# Altium schematic sheet Main.SchDoc
size A4; DocumentNumber: 1; SheetNumber: 1; SheetTotal: 8
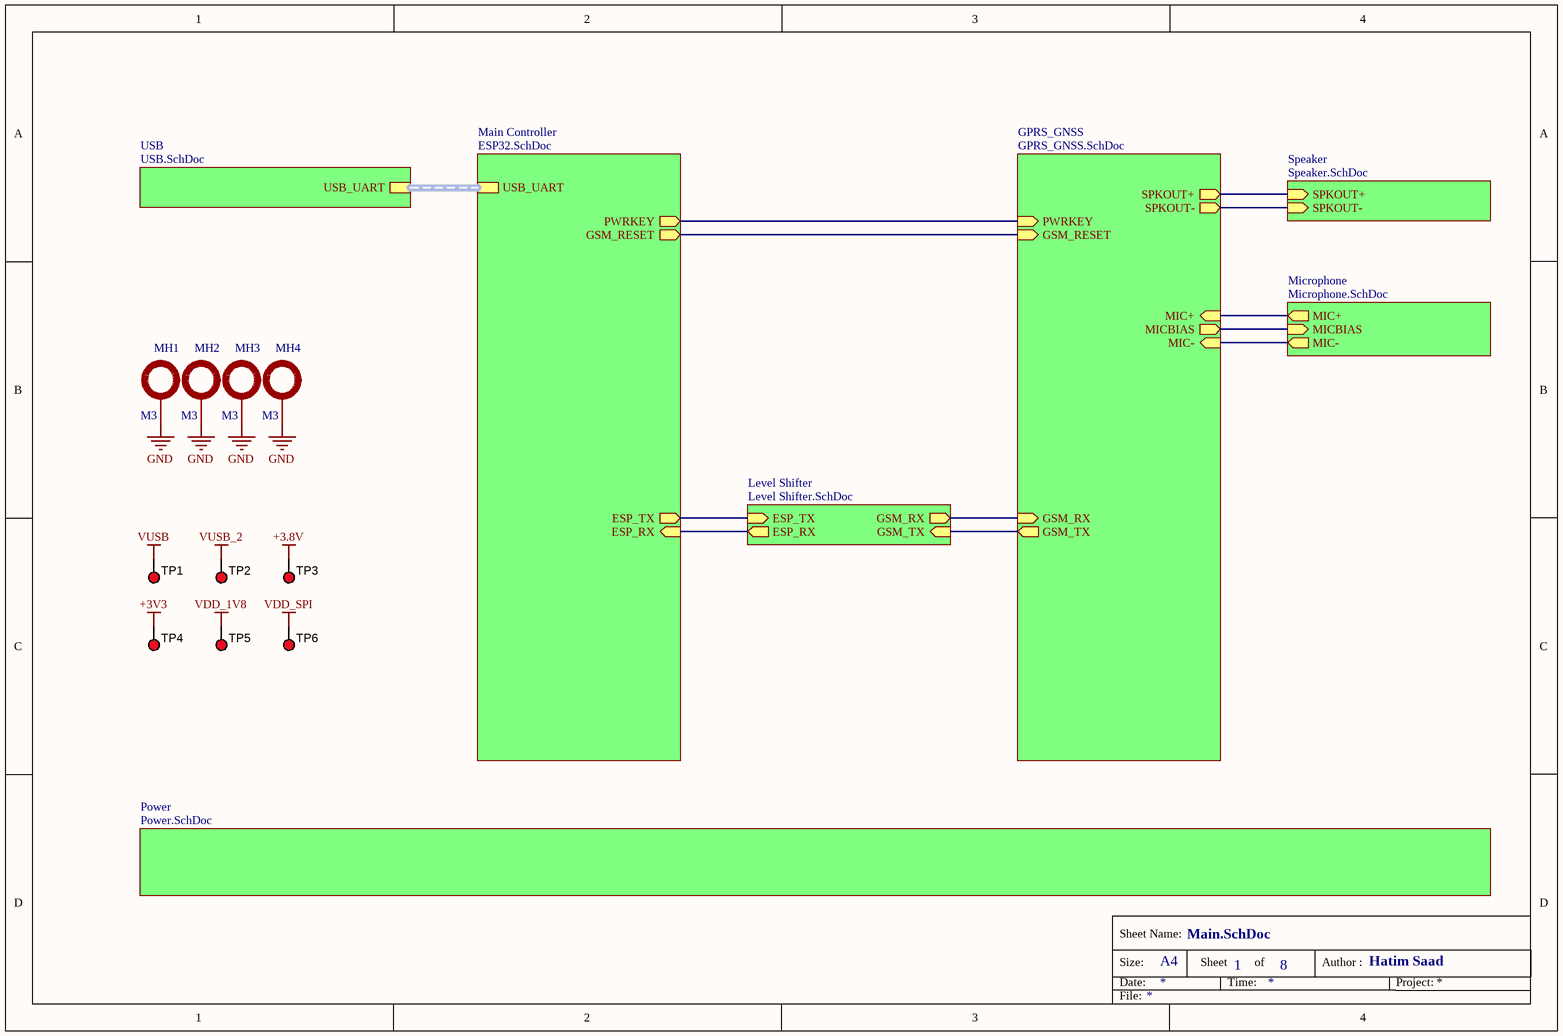
[diagram p0: Main.SchDoc]

## Parts
MH1  M3  [M3 Mounting Hole]
MH2  M3  [M3 Mounting Hole]
MH3  M3  [M3 Mounting Hole]
MH4  M3  [M3 Mounting Hole]
TP1  5010  [test point]  (value not drawn)  (no BOM)
TP2  5010  [test point]  (value not drawn)  (no BOM)
TP3  5010  [test point]  (value not drawn)  (no BOM)
TP4  5010  [test point]  (value not drawn)  (no BOM)
TP5  5010  [test point]  (value not drawn)  (no BOM)
TP6  5010  [test point]  (value not drawn)  (no BOM)

## Sub-sheets
GPRS_GNSS = GPRS_GNSS.SchDoc: PWRKEY (in), GSM_TX (out), GSM_RESET (in), GSM_RX (in), SPKOUT+ (out), SPKOUT- (out), MIC+ (in), MICBIAS (out), MIC- (in)
Level Shifter = Level Shifter.SchDoc: GSM_TX (in), ESP_TX (in), GSM_RX (out), ESP_RX (out)
Main Controller = ESP32.SchDoc: USB_UART (harness DEBUG), GSM_RESET (out), PWRKEY (out), ESP_TX (out), ESP_RX (in)
Microphone = Microphone.SchDoc: MICBIAS (in), MIC- (out), MIC+ (out)
Power = Power.SchDoc: no entries
Speaker = Speaker.SchDoc: SPKOUT+ (in), SPKOUT- (in)
USB = USB.SchDoc: USB_UART (harness DEBUG)

## Nets
+3.8V: TP3.1
+3V3: TP4.1
GND: MH1.1 MH2.1 MH3.1 MH4.1
VDD_1V8: TP5.1
VDD_SPI: TP6.1
VUSB: TP1.1
VUSB_2: TP2.1
(unnamed): sheet Main Controller/GSM_RESET, sheet GPRS_GNSS/GSM_RESET
(unnamed): sheet Main Controller/PWRKEY, sheet GPRS_GNSS/PWRKEY
(unnamed): sheet Main Controller/ESP_TX, sheet Level Shifter/ESP_TX
(unnamed): sheet Main Controller/ESP_RX, sheet Level Shifter/ESP_RX
(unnamed): sheet Microphone/MICBIAS, sheet GPRS_GNSS/MICBIAS
(unnamed): sheet Microphone/MIC-, sheet GPRS_GNSS/MIC-
(unnamed): sheet Microphone/MIC+, sheet GPRS_GNSS/MIC+
(unnamed): sheet GPRS_GNSS/GSM_TX, sheet Level Shifter/GSM_TX
(unnamed): sheet GPRS_GNSS/GSM_RX, sheet Level Shifter/GSM_RX
(unnamed): sheet GPRS_GNSS/SPKOUT+, sheet Speaker/SPKOUT+
(unnamed): sheet GPRS_GNSS/SPKOUT-, sheet Speaker/SPKOUT-

## Buses and harness runs
harness sheet Main Controller/USB_UART = sheet USB/USB_UART

## Notes on the sheet
- Size:
- Date:
- Sheet Name:
- A4
- Sheet
- Time:
- of
- Author :
- Hatim Saad
- Project:
- File:

## Library data of the parts
MH1-MH4 = Mounting Hole M3: Mounting Hole M3 Screw
TP1-TP6 = test point: Test Point, Multipurpose, Red, TH; Manufacturer: Keystone; CompType: Test Point Loop; U/M: EA; PartNumber: 5010; SymbolVersion: 2008-04-04; PackageReference: Red Multipurpose Testpoint; RoHS: Y; MountType: TH; ComponentLink1Description: Datasheet Link; ComponentLink1URL: http://www.keyelco.com/userAssets/file/M60-2p60.pdf; Value: Red; Publisher: Texas Instruments; LatestRevisionDate: 2015-08-25